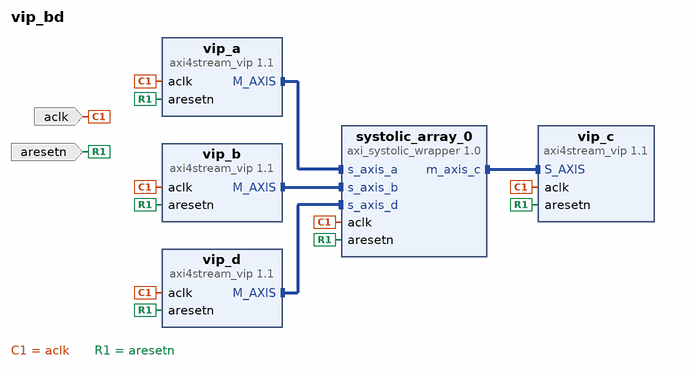
[diagram p0: block diagram of the top level]
# Vivado block design vip_bd, xc7z020clg484-1, Vivado 2023.1
create_bd_design vip_bd

create_bd_port -dir I -type clk aclk
set_property -dict {CONFIG.ASSOCIATED_RESET aresetn CONFIG.FREQ_HZ 100000000} [get_bd_ports aclk]
create_bd_port -dir I -type rst aresetn

create_bd_cell -type ip -vlnv xilinx.com:ip:axi4stream_vip:1.1 vip_a
set_property -dict [list \
  CONFIG.HAS_TKEEP 0 \
  CONFIG.HAS_TLAST 0 \
  CONFIG.HAS_TREADY 1 \
  CONFIG.HAS_TSTRB 0 \
  CONFIG.INTERFACE_MODE MASTER \
  CONFIG.TDATA_NUM_BYTES 32 \
  CONFIG.TDEST_WIDTH 1 \
  CONFIG.TID_WIDTH 1 \
  CONFIG.TUSER_WIDTH 0 \
] [get_bd_cells vip_a]
create_bd_cell -type ip -vlnv xilinx.com:ip:axi4stream_vip:1.1 vip_b
set_property -dict [list \
  CONFIG.HAS_TKEEP 0 \
  CONFIG.HAS_TLAST 0 \
  CONFIG.HAS_TREADY 1 \
  CONFIG.HAS_TSTRB 0 \
  CONFIG.INTERFACE_MODE MASTER \
  CONFIG.TDATA_NUM_BYTES 32 \
  CONFIG.TDEST_WIDTH 1 \
  CONFIG.TID_WIDTH 1 \
  CONFIG.TUSER_WIDTH 0 \
] [get_bd_cells vip_b]
create_bd_cell -type ip -vlnv xilinx.com:ip:axi4stream_vip:1.1 vip_d
set_property -dict [list \
  CONFIG.HAS_TKEEP 0 \
  CONFIG.HAS_TLAST 0 \
  CONFIG.HAS_TREADY 1 \
  CONFIG.HAS_TSTRB 0 \
  CONFIG.INTERFACE_MODE MASTER \
  CONFIG.TDATA_NUM_BYTES 32 \
  CONFIG.TDEST_WIDTH 1 \
  CONFIG.TID_WIDTH 1 \
  CONFIG.TUSER_WIDTH 0 \
] [get_bd_cells vip_d]
create_bd_cell -type ip -vlnv xilinx.com:ip:axi4stream_vip:1.1 vip_c
set_property -dict {CONFIG.INTERFACE_MODE SLAVE CONFIG.TDATA_NUM_BYTES 32} [get_bd_cells vip_c]
create_bd_cell -type ip -vlnv phanikar:user:axi_systolic_wrapper:1.0 systolic_array_0

# ---- connections ----

connect_bd_intf_net [get_bd_intf_pins systolic_array_0/m_axis_c] [get_bd_intf_pins vip_c/S_AXIS]
connect_bd_intf_net [get_bd_intf_pins vip_a/M_AXIS] [get_bd_intf_pins systolic_array_0/s_axis_a]
connect_bd_intf_net [get_bd_intf_pins vip_b/M_AXIS] [get_bd_intf_pins systolic_array_0/s_axis_b]
connect_bd_intf_net [get_bd_intf_pins vip_d/M_AXIS] [get_bd_intf_pins systolic_array_0/s_axis_d]
connect_bd_net [get_bd_ports aclk] \
  [get_bd_pins vip_a/aclk] [get_bd_pins vip_b/aclk] [get_bd_pins vip_d/aclk] [get_bd_pins vip_c/aclk] \
  [get_bd_pins systolic_array_0/aclk]
connect_bd_net [get_bd_ports aresetn] \
  [get_bd_pins vip_a/aresetn] [get_bd_pins vip_b/aresetn] [get_bd_pins vip_d/aresetn] [get_bd_pins vip_c/aresetn] \
  [get_bd_pins systolic_array_0/aresetn]

validate_bd_design
save_bd_design
